# Altium schematic sheet Main.SchDoc: MainBoard
size A4; Date: 9/26/2024; DocumentNumber: 1; Revision: 1; SheetNumber: 1; SheetTotal: 1
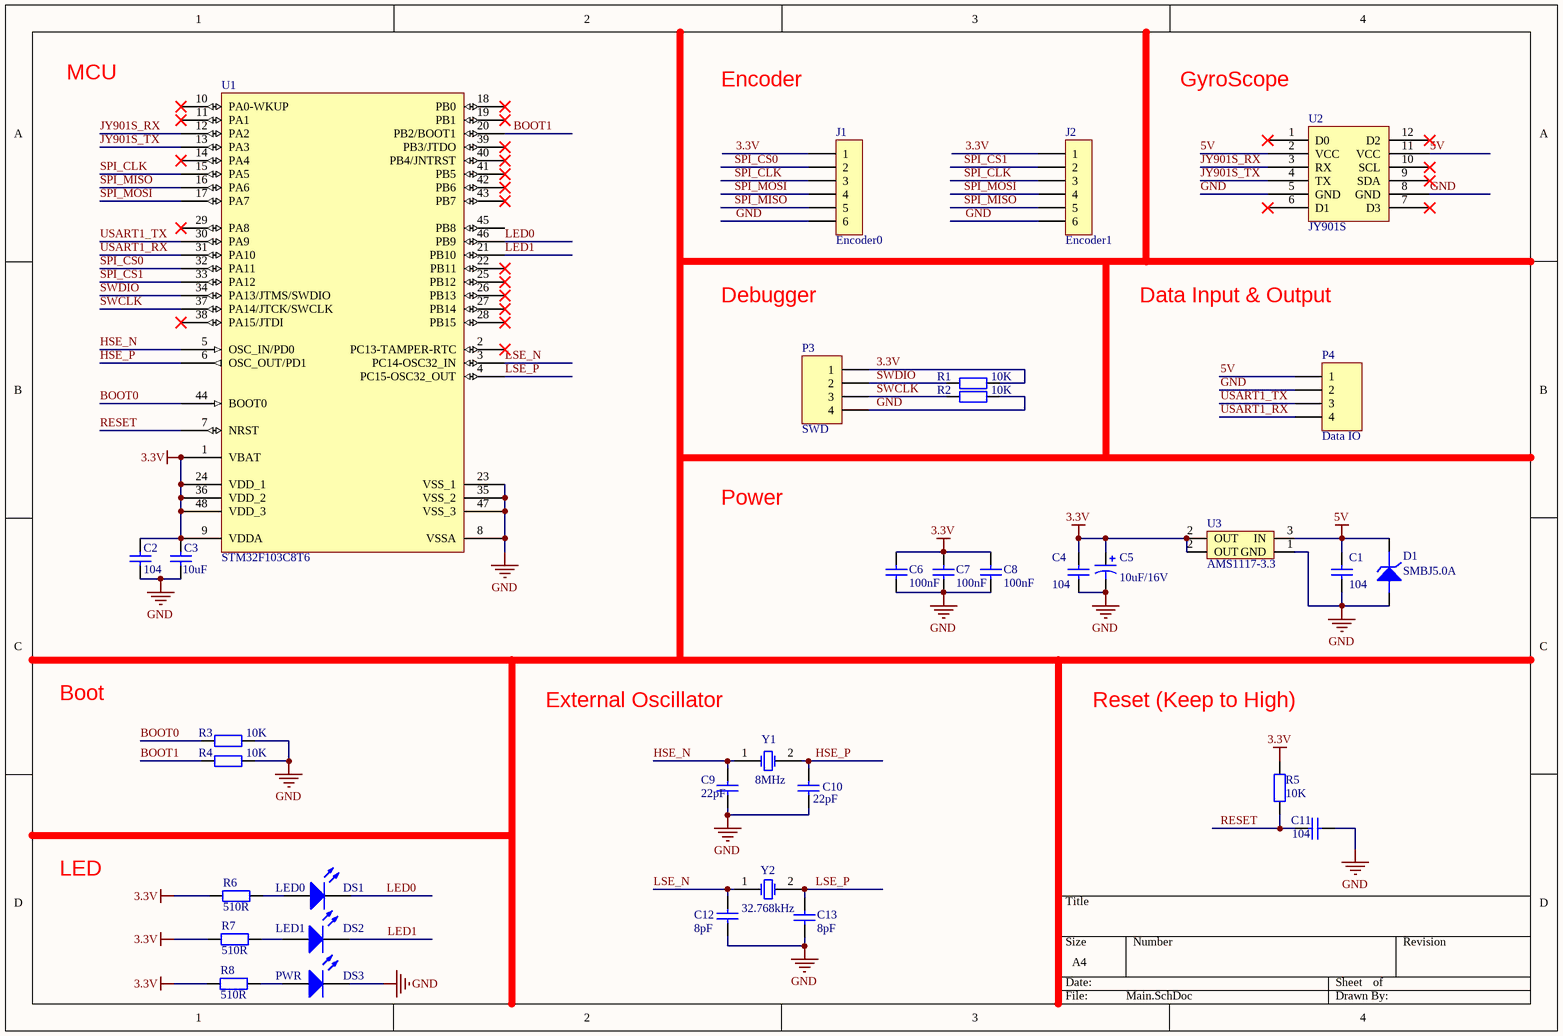
[diagram p0: Main.SchDoc]

## Parts
C1  value 104  [0603C]  (hidden comment: Capacitor)
C2  value 104  [0603C]  (hidden comment: Capacitor)
C3  value 10uF  [0603C]  (hidden comment: Capacitor)
C4  value 104  [0603C]  (hidden comment: Capacitor)
C5  value 10uF/16V  [TAJ-A/3216]  (hidden comment: Capacitor)
C6  value 100nF  [0603C]  (hidden comment: Capacitor)
C7  value 100nF  [0603C]  (hidden comment: Capacitor)
C8  value 100nF  [0603C]  (hidden comment: Capacitor)
C9  value 22pF  [0603C]  (hidden comment: Capacitor)
C10  value 22pF  [0603C]  (hidden comment: Capacitor)
C11  value 104  [0603C]  (hidden comment: Capacitor)
C12  value 8pF  [0603C]  (hidden comment: Capacitor)
C13  value 8pF  [0603C]  (hidden comment: Capacitor)
D1  value SMBJ5.0A  [SMB/DO-214AA]  (hidden comment: TVS Diode)
DS1  LED0  [LED-0805R]
DS2  LED1  [LED-0805R]
DS3  PWR  [LED-0805R]
J1  Encoder0  [6P_SMD]
J2  Encoder1  [6P_SMD]
P3  SWD  [Pin HDR1X4/2.54mm-S]
P4  Data IO  [XH4/2.54mm/180]
R1  value 10K  [0603R]  (hidden comment: Resistor)
R2  value 10K  [0603R]  (hidden comment: Resistor)
R3  value 10K  [0603R]  (hidden comment: Resistor)
R4  value 10K  [0603R]  (hidden comment: Resistor)
R5  value 10K  [0603R]  (hidden comment: Resistor)
R6  value 510R  [0603R]  (hidden comment: Resistor)
R7  value 510R  [0603R]  (hidden comment: Resistor)
R8  value 510R  [0603R]  (hidden comment: Resistor)
U1  value STM32F103C8T6  [LQFP48 7X7]  (hidden comment: ST MCU LQFP48)
U2  JY901S  [JY901S]
U3  AMS1117-3.3  [SOT223]
Y1  value 8MHz  [OSC 5032-2P]  (hidden comment: Crystal Oscillator)
Y2  value 32.768kHz  [OSC 3215-2P]  (hidden comment: Crystal Oscillator)

## Nets
3.3V: C2.2 C3.2 C4.2 C5.1 C6.2 C7.2 C8.2 J1.1 J2.1 P3.1 R1.2 R5.1 R6.1 R7.1 R8.1 U1.1(VBAT) U1.9(VDDA) U1.24(VDD_1) U1.36(VDD_2) U1.48(VDD_3) U3.2(OUT)
5V: C1.2 D1.K P4.1 U2.2(VCC) U2.11(VCC) U3.3(IN)
GND: C1.1 C2.1 C3.1 C4.1 C5.2 C6.1 C7.1 C8.1 C9.1 C10.1 C11.1 C12.1 C13.1 D1.A DS3.2(K) J1.6 J2.6 P3.4 P4.2 R2.2 R3.1 R4.1 U1.8(VSSA) U1.23(VSS_1) U1.35(VSS_2) U1.47(VSS_3) U2.5(GND) U2.8(GND) U3.1(GND)
BOOT0: R3.2 U1.44(BOOT0)
BOOT1: R4.2 U1.20(PB2/BOOT1)
HSE_N: C9.2 U1.5(OSC_IN/PD0) Y1.1(OSC1)
HSE_P: C10.2 U1.6(OSC_OUT/PD1) Y1.2(OSC2)
JY901S_RX: U1.12(PA2) U2.3(RX)
JY901S_TX: U1.13(PA3) U2.4(TX)
LED0: DS1.2(K) U1.46(PB9)
LED1: DS2.2(K) U1.21(PB10)
LSE_N: C12.2 U1.3(PC14-OSC32_IN) Y2.1(OSC1)
LSE_P: C13.2 U1.4(PC15-OSC32_OUT) Y2.2(OSC2)
RESET: C11.2 R5.2 U1.7(NRST)
SPI_CLK: J1.3 J2.3 U1.15(PA5)
SPI_CS0: J1.2 U1.32(PA11)
SPI_CS1: J2.2 U1.33(PA12)
SPI_MISO: J1.5 J2.5 U1.16(PA6)
SPI_MOSI: J1.4 J2.4 U1.17(PA7)
SWCLK: P3.3 R2.1 U1.37(PA14/JTCK/SWCLK)
SWDIO: P3.2 R1.1 U1.34(PA13/JTMS/SWDIO)
USART1_RX: P4.4 U1.31(PA10)
USART1_TX: P4.3 U1.30(PA9)
NetDS1_1: DS1.1(A) R6.2
NetDS2_1: DS2.1(A) R7.2
NetDS3_1: DS3.1(A) R8.2

Not connected (* = marked no-connect by the designer): U1 2(PC13-TAMPER-RTC)* 10(PA0-WKUP)* 11(PA1)* 14(PA4)* 18(PB0)* 19(PB1)* 22(PB11)* 25(PB12)* 26(PB13)* 27(PB14)* 28(PB15)* 29(PA8)* 38(PA15/JTDI)* 39(PB3/JTDO)* 40(PB4/JNTRST)* 41(PB5)* 42(PB6)* 43(PB7)* 45(PB8); U2 1(D0)* 6(D1)* 7(D3)* 9(SDA)* 10(SCL)* 12(D2)*

## Notes on the sheet
- MCU
- Encoder
- GyroScope
- Debugger
- Data Input & Output
- Power
- Boot
- External Oscillator
- Reset (Keep to High)
- LED

## Library data of the parts
C1-C4 C6-C13 = Cap: Published: 8-Jun-2000; LatestRevisionDate: 17-Jul-2002; LatestRevisionNote: Re-released for DXP Platform.; PackageReference: RAD-0.3; Publisher: Altium Limited
  C2 C3 C6-C13: PackageDescription: Radial Cap, Thru-Hole; 2 Leads; 0.3 in Pin Spacing
C5 = Cap Pol1: Polarized Capacitor (Radial); Published: 8-Jun-2000; LatestRevisionDate: 17-Jul-2002; LatestRevisionNote: Re-released for DXP Platform.; PackageReference: RB7.6-15; Publisher: Altium Limited
D1 = DIODE ZENER: 稳压二极管
DS1 = LED1: Typical RED GaAs LED; pin to pad: 1>A 2>K; Value: Blue; Published: 8-Jun-2000; LatestRevisionDate: 08-Jul-2005; LatestRevisionNote: Mech Layer 1 removed.; PackageReference: LED-1; Publisher: Altium Limited; PackageDescription: LED; 2 Leads
DS2 = LED1: Typical RED GaAs LED; pin to pad: 1>A 2>K; Published: 8-Jun-2000; LatestRevisionDate: 08-Jul-2005; LatestRevisionNote: Mech Layer 1 removed.; PackageReference: LED-1; Publisher: Altium Limited; PackageDescription: LED; 2 Leads; Value: Red
DS3 = LED1: Typical RED GaAs LED; pin to pad: 1>A 2>K; Value: Green; Published: 8-Jun-2000; LatestRevisionDate: 08-Jul-2005; LatestRevisionNote: Mech Layer 1 removed.; PackageReference: LED-1; Publisher: Altium Limited; PackageDescription: LED; 2 Leads
J1 J2 = Header 6
P3 P4 = Header 4: Header, 4-Pin; LatestRevisionDate: 17-Jul-2002; LatestRevisionNote: Re-released for DXP Platform.; Publisher: Altium Limited
R1-R8 = Res2: Published: 8-Jun-2000; LatestRevisionDate: 17-Jul-2002; LatestRevisionNote: Re-released for DXP Platform.; PackageReference: AXIAL-0.4; Publisher: Altium Limited; PackageDescription: Axial Device, Thru-Hole; 2 Leads; 0.4 in Pin Spacing
U1 = STM32F103C8T6
U3 = AMS1117
Y1 Y2 = XTAL: Published: *; LatestRevisionDate: *; LatestRevisionNote: *; Publisher: *